# EAGLE design GridThumbs (EAGLE 9.0.1)
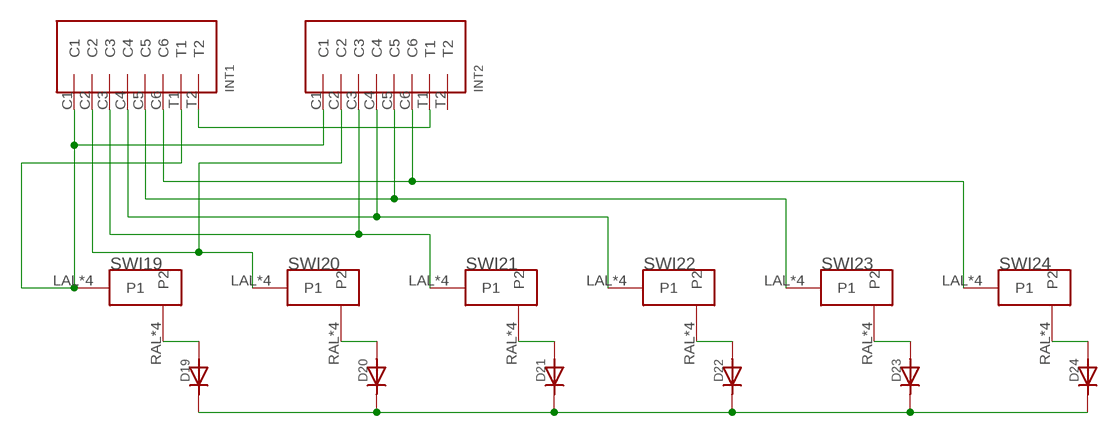
[diagram p0: schematic, sheet 1]

## Parts
D19  DIODE  [DIODE_COMBO]
D20  DIODE  [DIODE_COMBO]
D21  DIODE  [DIODE_COMBO]
D22  DIODE  [DIODE_COMBO]
D23  DIODE  [DIODE_COMBO]
D24  DIODE  [DIODE_COMBO]
INT1  INTRCNNT  [INTRCNNT]
INT2  INTRCNNT  [INTRCNNT]
SWI19  MX/ALPSDOUBLESIDED  [DOUBLED_MX/ALPS]
SWI20  MX/ALPSDOUBLESIDED  [DOUBLED_MX/ALPS]
SWI21  MX/ALPSDOUBLESIDED  [DOUBLED_MX/ALPS]
SWI22  MX/ALPSDOUBLESIDED  [DOUBLED_MX/ALPS]
SWI23  MX/ALPSDOUBLESIDED  [DOUBLED_MX/ALPS]
SWI24  MX/ALPSDOUBLESIDED  [DOUBLED_MX/ALPS]

## Nets
N$2: INT1.C2 INT2.C2 SWI20.LAL(P1) SWI20.LAR(P1) SWI20.LCL(P1) SWI20.LCR(P1)
N$3: INT1.C3 INT2.C3 SWI21.LAL(P1) SWI21.LAR(P1) SWI21.LCL(P1) SWI21.LCR(P1)
N$4: INT1.C4 INT2.C4 SWI22.LAL(P1) SWI22.LAR(P1) SWI22.LCL(P1) SWI22.LCR(P1)
N$5: INT1.C5 INT2.C5 SWI23.LAL(P1) SWI23.LAR(P1) SWI23.LCL(P1) SWI23.LCR(P1)
N$6: INT1.C6 INT2.C6 SWI24.LAL(P1) SWI24.LAR(P1) SWI24.LCL(P1) SWI24.LCR(P1)
N$7: D19.ANOSB(AN) D19.ANOST(AN) D19.ANOT(AN) SWI19.RAL(P2) SWI19.RAR(P2) SWI19.RCL(P2) SWI19.RCR(P2)
N$8: D20.ANOSB(AN) D20.ANOST(AN) D20.ANOT(AN) SWI20.RAL(P2) SWI20.RAR(P2) SWI20.RCL(P2) SWI20.RCR(P2)
N$9: D21.ANOSB(AN) D21.ANOST(AN) D21.ANOT(AN) SWI21.RAL(P2) SWI21.RAR(P2) SWI21.RCL(P2) SWI21.RCR(P2)
N$10: D22.ANOSB(AN) D22.ANOST(AN) D22.ANOT(AN) SWI22.RAL(P2) SWI22.RAR(P2) SWI22.RCL(P2) SWI22.RCR(P2)
N$11: D23.ANOSB(AN) D23.ANOST(AN) D23.ANOT(AN) SWI23.RAL(P2) SWI23.RAR(P2) SWI23.RCL(P2) SWI23.RCR(P2)
N$12: D24.ANOSB(AN) D24.ANOST(AN) D24.ANOT(AN) SWI24.RAL(P2) SWI24.RAR(P2) SWI24.RCL(P2) SWI24.RCR(P2)
N$14: INT1.T2 INT2.T1
N$19: D19.CATSB(CAT) D19.CATST(CAT) D19.CATT(CAT) D20.CATSB(CAT) D20.CATST(CAT) D20.CATT(CAT) D21.CATSB(CAT) D21.CATST(CAT) D21.CATT(CAT) D22.CATSB(CAT) D22.CATST(CAT) D22.CATT(CAT) D23.CATSB(CAT) D23.CATST(CAT) D23.CATT(CAT) D24.CATSB(CAT) D24.CATST(CAT) D24.CATT(CAT)
N$21: INT1.C1 INT1.T1 INT2.C1 SWI19.LAL(P1) SWI19.LAR(P1) SWI19.LCL(P1) SWI19.LCR(P1)
Unconnected: INT2.T2

## Library data of the parts
D19-D24 = Keys:DIODE
INT1 INT2 = Keys:INTRCNNT
SWI19-SWI24 = Keys:MX/ALPS

## Board
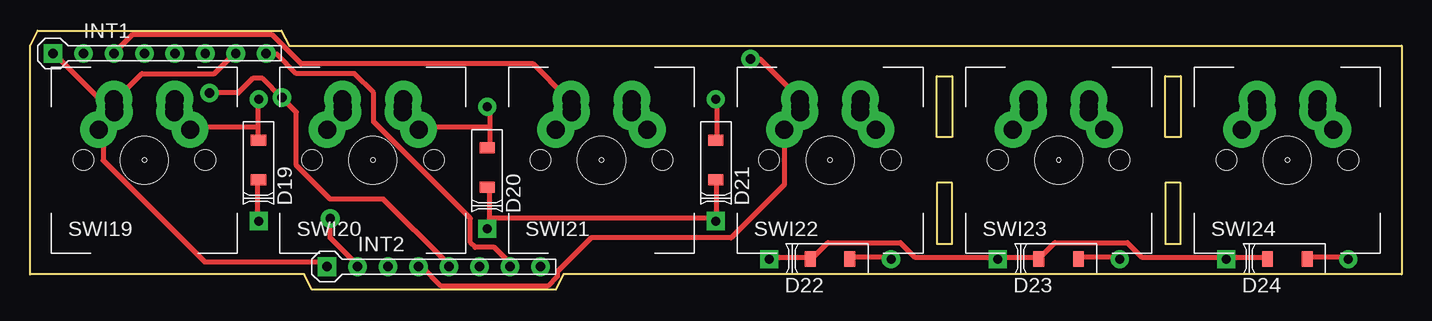
[diagram p1: board, top side]
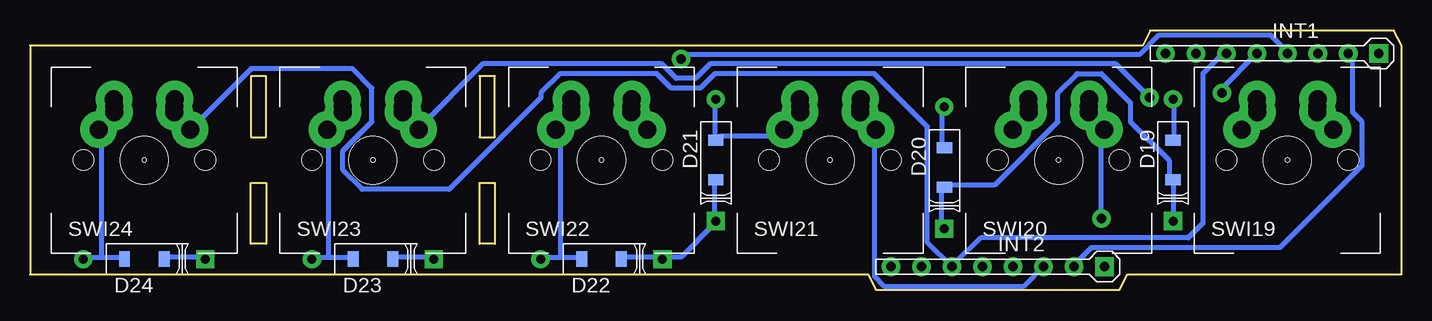
[diagram p2: board, bottom side, seen from below]

Size 114.3 x 21.59 mm. Coordinates in mm from the lower left corner, seen from the top.
Outline: 94.62,17.78 95.89,17.78 95.89,12.7 94.62,12.7 94.62,17.78
Outline: 94.62,3.81 95.89,3.81 95.89,8.89 94.62,8.89 94.62,3.81
Outline: 76.84,3.81 76.84,8.89 75.57,8.89 75.57,3.81 76.84,3.81
Outline: 75.57,17.78 76.84,17.78 76.84,12.7 75.57,12.7 75.57,17.78
Outline: 0,1.27 0,20.32 0.63,21.59 20.95,21.59 21.59,20.32 114.3,20.32 114.3,1.27 44.45,1.27 43.81,0 23.49,0 22.86,1.27 0,1.27
Copper layers (1*16): Top 0.035mm / dielectric 1.5mm / Bottom 0.035mm
Design rules "ModOthermill_1_64": minimum track width 16mil, minimum drill 31mil, track to track 0.39878125mm, track to pad 0.39878125mm, pad to pad 0.39878125mm, via to via 0.39878125mm, smd to smd 0mil, copper to edge 0mil, drill to drill 1mil, minimum pad ring 15mil, minimum via ring 15mil, stop-mask expansion 1mil, vias tented up to drill 30mil, thermal gap 10mil

### Footprints (pad centres in the part's own frame; a part is rotated, then mirrored left to right if it is on the bottom)
DIODE_COMBO = smd 0.914 x 1.27 bottom: ANOSB 1.651,0; CATSB -1.651,0 | smd 0.914 x 1.27: ANOST 1.651,0; CATST -1.651,0 | drill 0.75: ANOT 5.08,0 | drill 0.75 square: CATT -5.08,0
INTRCNNT = drill 0.787 pad 1.143 square: C1 0,0 | drill 0.787 pad 1.143: C2 2.54,0; C3 5.08,0; C4 7.62,0; C5 10.16,0; C6 12.7,0; T1 15.24,0; T2 17.78,0
DOUBLED_MX/ALPS = drill 1.5 pad 3.048: LAL -2.5,4; RAL 2.5,4 | drill 1.5: LAR -2.5,4.5; RAR 2.5,4.5 | drill 1.499 pad 3.048: LCL -3.81,2.54; LCR -2.54,5.08; RCL 3.81,2.54; RCR 2.54,5.08 | hole 0.35: 0,0 | hole 3.988: 0,0 | hole 1.702: -5.08,0; 5.08,0

### Placement (x,y rotation side)
D19  19.05,10.79 90 top
D20  38.1,10.16 90 top
D21  57.15,10.79 90 top
D22  66.68,2.54 0 top
D23  85.73,2.54 0 top
D24  104.78,2.54 0 top
INT1  1.9,19.68 0 top
INT2  24.77,1.91 0 top
SWI19  9.53,10.79 0 top
SWI20  28.57,10.79 0 top
SWI21  47.62,10.79 0 top
SWI22  66.68,10.79 0 top
SWI23  85.73,10.79 0 top
SWI24  104.78,10.79 0 top

### Tracks (layer width: path | path; a pad name or v marks a point on that pad's centre or on a via)
N$2  (via drill 0.79)
  Top 0.406: SWI20.LAR 26.23,15.19 SWI20.LAL | SWI20.LCL 25.02,13.58 26.23,14.78 SWI20.LAR | SWI20.LCR 26.23,15.59 SWI20.LAR | v25.02,5.93 25.02,4.32 27.03,2.3 INT2.C2
  Bottom 0.406: INT1.C2 4.08,19.61 4.08,14.78 3.28,13.98 3.28,10.36 10.12,3.51 25.82,3.51 27.03,2.3 INT2.C2 | v25.02,5.93 25.02,13.17 SWI20.LCL
N$3
  Top 0.406: 44.75,15.99 41.93,18.81 22.6,18.81 20.19,21.23 8.51,21.23 7.31,20.02 INT1.C3 | 44.75,15.99 SWI21.LAR 45.15,15.19 SWI21.LAL 44.75,15.99 | 44.75,15.99 SWI21.LCR 45.15,14.78 43.94,13.58 SWI21.LCL
  Bottom 0.406: INT2.C3 31.46,0.29 43.14,0.29 43.94,1.1 43.94,13.17 SWI21.LCL
N$4  (via drill 0.79)
  Top 0.406: INT2.C4 32.67,1.9 34.28,0.29 43.14,0.29 43.94,1.1 43.94,1.5 46.76,4.32 58.43,4.32 62.86,8.75 62.86,13.17 SWI22.LCL 63.26,13.58 64.47,14.78 SWI22.LCR 64.07,15.99 | v60.04,19.21 60.85,19.21 64.07,15.99 | 64.07,15.99 SWI22.LAR 64.47,15.19 SWI22.LAL 64.07,15.99
  Bottom 0.406: v60.04,19.21 59.64,19.61 21.8,19.61 20.19,21.23 10.93,21.23 9.72,20.02 INT1.C4
N$5  (via drill 0.79)
  Top 0.406: 83.4,15.19 SWI23.LCR | SWI23.LCL 82.19,13.58 83.4,14.78 SWI23.LAL 83.4,15.19 | 83.4,15.19 SWI23.LAR | v14.95,16.39 17.37,16.39 18.58,17.6 19.38,17.6 v20.99,15.99 22.2,14.78 22.2,10.36 25.02,7.54 29.45,7.54 34.68,2.3 INT2.C5
  Bottom 0.406: v14.95,16.39 14.95,16.8 12.14,19.61 INT1.C5 | v20.99,15.99 23.81,18.81 57.63,18.81 58.84,17.6 60.45,17.6 61.65,18.81 76.55,18.81 81.78,13.58 SWI23.LCL
N$6
  Top 0.406: 102.32,15.19 SWI24.LCR | SWI24.LCL 101.11,13.58 102.32,14.78 SWI24.LAL 102.32,15.19 | 102.32,15.19 SWI24.LAR
  Bottom 0.406: INT1.C6 14.95,19.61 16.56,18 16.56,5.52 17.77,4.32 35.08,4.32 37.1,2.3 INT2.C6 37.5,1.9 39.51,3.91 39.51,13.58 43.94,18 57.23,18 58.43,16.8 60.85,16.8 62.06,18 70.11,18 71.72,16.39 71.72,15.99 79.37,8.34 86.62,8.34 88.23,9.95 88.23,11.56 85.81,13.98 85.81,16.8 87.42,18.41 95.88,18.41 100.71,13.58 SWI24.LCL
N$7
  Top 0.406: 18.98,13.58 18.98,15.59 D19.ANOT | 18.98,13.58 18.98,12.77 D19.ANOST | 18.98,13.58 13.34,13.58 SWI19.RCL
  Bottom 0.406: D19.ANOST 18.98,12.77 18.98,15.59 D19.ANOT
N$8
  Top 0.406: 38.3,13.58 38.3,15.19 D20.ANOT | 38.3,13.58 38.3,11.97 D20.ANOST | 38.3,13.58 32.67,13.58 SWI20.RCL
  Bottom 0.406: D20.ANOST 38.3,11.97 38.3,15.19 D20.ANOT
N$9
  Top 0.406: D21.ANOST 57.23,12.77 57.23,15.59 D21.ANOT
  Bottom 0.406: D21.ANOT 57.23,15.59 57.23,12.77 D21.ANOST 56.82,12.77 51.99,12.77 51.59,13.17 SWI21.RCL
N$10
  Top 0.406: D22.ANOST 68.5,2.71 71.72,2.71 D22.ANOT
  Bottom 0.406: 70.11,2.71 71.72,2.71 D22.ANOT | 70.11,2.71 68.5,2.71 D22.ANOST | 70.11,2.71 70.11,13.17 SWI22.RCL
N$11
  Top 0.406: D23.ANOST 87.42,2.71 90.64,2.71 D23.ANOT
  Bottom 0.406: 89.43,2.71 90.64,2.71 D23.ANOT | 89.43,2.71 87.42,2.71 D23.ANOST | 89.43,2.71 89.43,13.17 SWI23.RCL
N$12
  Top 0.406: D24.ANOST 106.75,2.71 109.56,2.71 D24.ANOT
  Bottom 0.406: 108.36,2.71 109.56,2.71 D24.ANOT | 108.36,2.71 106.75,2.71 D24.ANOST | 108.36,2.71 108.36,13.17 SWI24.RCL
N$14
  Top 0.406: INT1.T2 19.78,19.61 20.59,19.61 22.2,18 27.03,18 28.64,16.39 28.64,13.98 36.69,5.93 36.69,3.91 37.1,3.51 38.71,3.51 39.91,2.3 INT2.T1
N$19
  Top 0.406: D24.CATST 103.12,2.71 99.9,2.71 D24.CATT 99.5,2.71 92.65,2.71 91.45,3.91 85.41,3.91 84.2,2.71 D23.CATST 83.8,2.71 80.98,2.71 D23.CATT 80.58,2.71 73.73,2.71 72.53,3.91 66.49,3.91 65.28,2.71 D22.CATST 64.88,2.71 61.65,2.71 D22.CATT | D19.CATST 18.98,8.75 18.98,5.93 D19.CATT | 38.3,5.93 38.3,5.12 D20.CATT | 38.3,5.93 38.3,8.34 D20.CATST | D21.CATST 57.23,8.75 57.23,5.93 D21.CATT 56.82,5.93 38.3,5.93
  Bottom 0.406: D24.CATST 103.12,2.71 99.9,2.71 D24.CATT | D23.CATST 83.8,2.71 80.98,2.71 D23.CATT | D22.CATST 64.88,2.71 61.65,2.71 D22.CATT 61.25,2.71 60.04,2.71 57.23,5.52 D21.CATT 57.23,5.93 57.23,8.75 D21.CATST | D19.CATT 18.98,5.93 18.98,8.75 D19.CATST 19.38,9.15 19.38,10.76 22.6,13.98 22.6,15.59 25.02,18 27.03,18 28.64,16.39 28.64,13.98 33.88,8.75 37.9,8.75 D20.CATST 38.3,8.34 38.3,5.12 D20.CATT
N$21
  Top 0.406: INT1.C1 2.07,19.61 5.69,15.99 6.9,15.99 SWI19.LCR | 7.31,15.99 9.32,18 15.36,18 16.97,19.61 INT1.T1 | 7.31,15.99 SWI19.LAR 7.31,15.19 SWI19.LAL 7.31,15.99 | 7.31,15.99 SWI19.LCR | INT2.C1 24.62,2.3 14.55,2.3 6.1,10.76 6.1,13.17 SWI19.LCL 5.69,13.58 6.9,14.78 SWI19.LCR